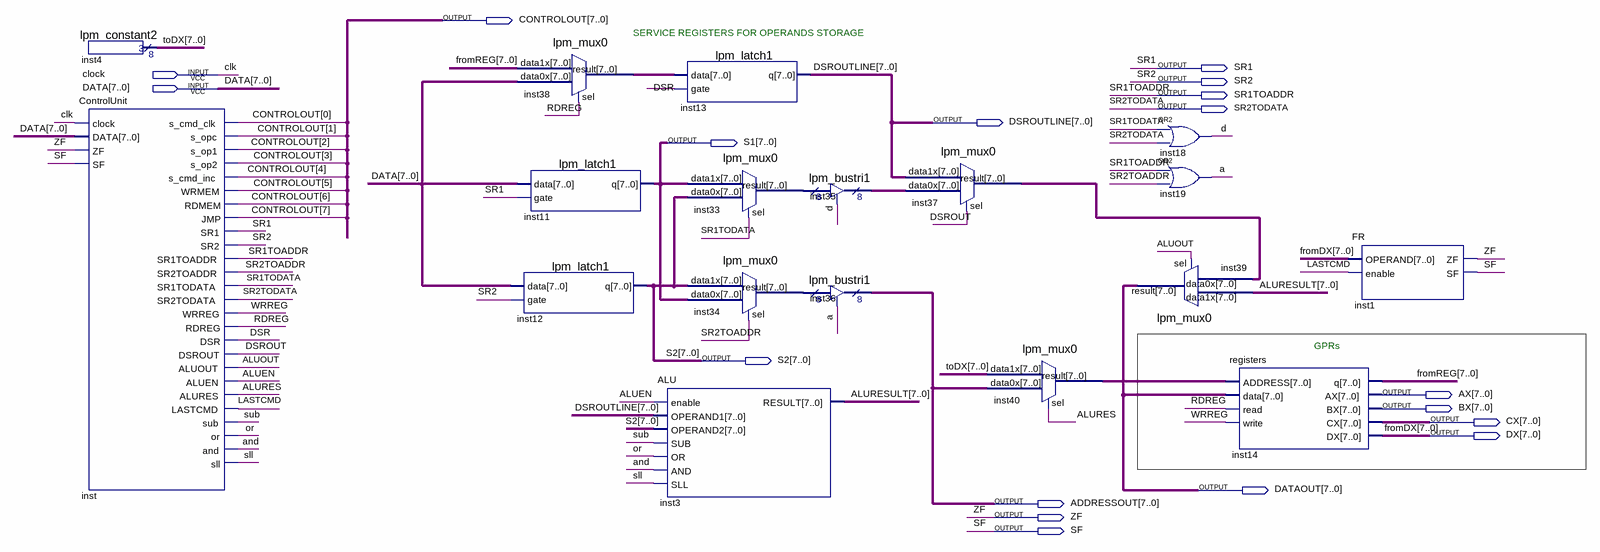
[diagram p0: schematic sheet]
// Quartus schematic CPU.bdf as structural Verilog: 18 symbols, 18 pins
module CPU (
  input  clock,
  input  [7:0] DATA,
  output [7:0] CONTROLOUT,
  output SR1,
  output SR2,
  output SR1TOADDR,
  output SR2TODATA,
  output [7:0] DSROUTLINE,
  output [7:0] S1,
  output [7:0] S2,
  output [7:0] AX,
  output [7:0] BX,
  output [7:0] CX,
  output [7:0] DX,
  output [7:0] DATAOUT,
  output [7:0] ADDRESSOUT,
  output ZF,
  output SF
);

  wire a, ALUEN, ALUOUT, ALURES, \and , d, DSR, DSROUT, LASTCMD, \or , RDREG, sll, SR1TODATA, SR2TOADDR, sub,
       WRREG;
  wire [7:0] ALURESULT, fromREG, inst33_result, inst34_result, inst35_tridata, inst37_result, inst38_result,
       inst40_result, toDX;

  lpm_constant2 inst4 (.result(toDX));
  ControlUnit inst (
    .clock(clock), .DATA(DATA), .ZF(ZF), .SF(SF), .s_cmd_clk(CONTROLOUT[0]), .s_opc(CONTROLOUT[1]),
    .s_op1(CONTROLOUT[2]), .s_op2(CONTROLOUT[3]), .s_cmd_inc(CONTROLOUT[4]), .WRMEM(CONTROLOUT[5]),
    .RDMEM(CONTROLOUT[6]), .JMP(CONTROLOUT[7]), .SR1(SR1), .SR2(SR2), .SR1TOADDR(SR1TOADDR),
    .SR2TOADDR(SR2TOADDR), .SR1TODATA(SR1TODATA), .SR2TODATA(SR2TODATA), .WRREG(WRREG), .RDREG(RDREG),
    .DSR(DSR), .DSROUT(DSROUT), .ALUOUT(ALUOUT), .ALUEN(ALUEN), .ALURES(ALURES), .LASTCMD(LASTCMD),
    .sub(sub), .\or (\or ), .\and (\and ), .sll(sll));
  lpm_mux0 inst38 (.data1x(fromREG), .data0x(DATA), .sel(RDREG), .result(inst38_result));
  lpm_latch1 inst11 (.data(DATA), .gate(SR1), .q(S1));
  lpm_latch1 inst12 (.data(DATA), .gate(SR2), .q(S2));
  lpm_latch1 inst13 (.data(inst38_result), .gate(DSR), .q(DSROUTLINE));
  lpm_mux0 inst33 (.data1x(S1), .data0x(S2), .sel(SR1TODATA), .result(inst33_result));
  lpm_mux0 inst34 (.data1x(S2), .data0x(S1), .sel(SR2TOADDR), .result(inst34_result));
  ALU inst3 (
    .enable(ALUEN), .OPERAND1(DSROUTLINE), .OPERAND2(S2), .SUB(sub), .OR(\or ), .AND(\and ), .SLL(sll),
    .RESULT(ALURESULT));
  lpm_bustri1 inst35 (.enabledt(d), .data(inst33_result), .tridata(inst35_tridata));
  lpm_bustri1 inst36 (.enabledt(a), .data(inst34_result), .tridata(ADDRESSOUT));
  lpm_mux0 inst37 (.data1x(DSROUTLINE), .data0x(inst35_tridata), .sel(DSROUT), .result(inst37_result));
  lpm_mux0 inst40 (.data1x(toDX), .data0x(ADDRESSOUT), .sel(ALURES), .result(inst40_result));
  or inst18 (d, SR1TODATA, SR2TODATA);
  or inst19 (a, SR1TOADDR, SR2TOADDR);
  lpm_mux0 inst39 (.data1x(ALURESULT), .data0x(inst37_result), .sel(ALUOUT), .result(DATAOUT));
  registers inst14 (
    .ADDRESS(inst40_result), .data(DATAOUT), .read(RDREG), .write(WRREG), .q(fromREG), .AX(AX), .BX(BX),
    .CX(CX), .DX(DX));
  FR inst1 (.OPERAND(DX), .enable(LASTCMD), .ZF(ZF), .SF(SF));

  // Other names for the same wires on the sheet: clk = clock; fromDX[7:0] = DX

  // Notes on the sheet:
  //   SERVICE REGISTERS FOR OPERANDS STORAGE
  //   GPRs
endmodule
